# Altium schematic sheet AUX_PowerSupply.SchDoc
size A4
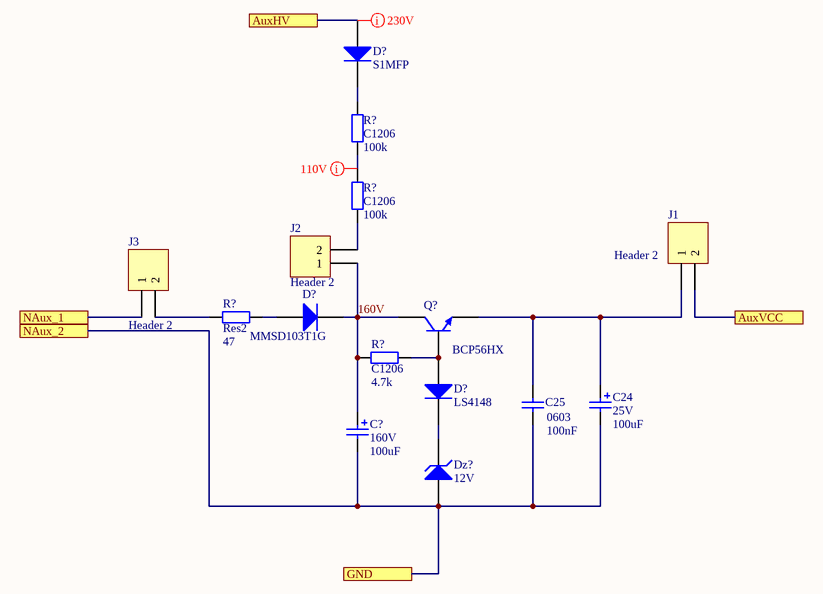
[diagram p0: AUX_PowerSupply.SchDoc]

## Parts
(Parts that share a designator on the sheet are numbered #1, #2 ... from top to bottom, then left to right.)
C24  25V  value 100uF  [100uF25V]
C25  0603  value 100nF  [1608[0603]]
C?  160V  value 100uF  [cap d=6.3]
D?#1  S1MFP  [MRA4007T3G]
D?#2  MMSD103T1G  [SOD-123]
D?#3  LS4148  [SOD-80]
Dz?  12V  [12V Zener]
J1  Header 2  [HDR1X2]
J2  Header 2  [HDR1X2]
J3  Header 2  [HDR1X2]
Q?  BCP56HX  [SOT223_M]
R?#1  C1206  value 100k  [C1206]
R?#2  C1206  value 100k  [C1206]
R?#3  Res2  value 47  [1608[0603]]
R?#4  C1206  value 4.7k  [C1206]

## Ports
AuxHV, AuxVCC, GND, NAux_1, NAux_2

## Nets
160V: C?.1 D?#2.2(K) J2.1 Q?.2(C) R?#4.2
AuxHV: D?#1.1(A) ; port AuxHV
AuxVCC: J1.2 ; port AuxVCC
GND: C24.2 C25.1 C?.2 Dz?.1(A) ; port NAux_2, port GND
NAux_1: J3.1 ; port NAux_1
NetC24_1: C24.1 C25.2 J1.1 Q?.3(E)
NetD?#1_2: D?#1.2(K) R?#1.2
NetD?#2_1: D?#2.1(A) R?#3.1
NetD?#3_1: D?#3.1(A) Q?.1(B) R?#4.1
NetD?#3_2: D?#3.2(K) Dz?.2(K)
NetJ2_2: J2.2 R?#2.1
NetJ3_2: J3.2 R?#3.2
NetR?#1_1: R?#1.1 R?#2.2

## Layout directives
mark named 230V: AuxHV
mark named 110V: NetR?#1_1

## Library data of the parts
C24 C? = Cap Pol2: Polarized Capacitor (Axial); Published: 8-Jun-2000; LatestRevisionDate: 17-Jul-2002; LatestRevisionNote: Re-released for DXP Platform.; PackageReference: POLAR0.8; Publisher: Altium Limited; PackageDescription: Polarized Capacitor; 2 Leads; Supplier 1: Digi-Key; Supplier Part Number 1: 493-2703-ND
C25 = Cap: Capacitor; Published: 8-Jun-2000; LatestRevisionDate: 17-Jul-2002; LatestRevisionNote: Re-released for DXP Platform.; PackageReference: RAD-0.3; Publisher: Altium Limited; PackageDescription: Radial Cap, Thru-Hole; 2 Leads; 0.3 in Pin Spacing; Supplier 1: Digi-Key; Supplier Part Number 1: 478-1138-6-ND
D?#1-D?#3 = Diode: Default Diode; Published: 8-Jun-2000; LatestRevisionDate: 17-Jul-2002; LatestRevisionNote: Re-released for DXP Platform.; PackageVersion: Sep-1996; PackageReference: SMC; Publisher: Altium Limited; PackageDescription: DO-214-AB/SMC; 2 C-Bend Leads; Body 7.9 x 5.9 mm, inc. leads (LxW); Code_JEDEC: DO-214-AB
  D?#1: Supplier 1: Mouser; Supplier Part Number 1: 863-MRA4007T3G
  D?#2: Supplier 1: Mouser; Supplier Part Number 1: 863-MMSD103T1G
Dz? = D Zener: Zener Diode; Published: 8-Jun-2000; LatestRevisionDate: 17-Jul-2002; LatestRevisionNote: Re-released for DXP Platform.; PackageReference: DIODE-0.7; Publisher: Altium Limited; PackageDescription: Diode, Thru-Hole; 2 Leads; 0.7 in Pin Spacing
J1-J3 = Header 2: Header, 2-Pin; LatestRevisionDate: 17-Jul-2002; LatestRevisionNote: Re-released for DXP Platform.; Publisher: Altium Limited
Q? = 2N3904: NPN General Purpose Amplifier; Published: 8-Jun-2000; LatestRevisionDate: 15-Jan-2003; LatestRevisionNote: PCB Footprint 'BCY-W3/D4.7' replaced; DatasheetVersion: 1997; PackageVersion: Sep-1998; PackageReference: TO-92A; Publisher: Altium Limited; PackageDescription: TO, Flat Index; 3 In-Line, Axial Leads; Body Dia. 4.5mm; Leads 0.51 x 0.48 mm (max); ComponentLink1Description: Manufacturer Link; ComponentLink1URL: http://www.fairchildsemi.com/; ComponentLink2Description: Datasheet; ComponentLink2URL: http://www.fairchildsemi.com/ds/2N%2F2N3904.pdf; Supplier 1: Arrow Electronics, Inc.; Supplier Part Number 1: BCP55-16F
R?#1-R?#4 = Res2: Resistor; Published: 8-Jun-2000; LatestRevisionDate: 17-Jul-2002; LatestRevisionNote: Re-released for DXP Platform.; PackageReference: AXIAL-0.4; Publisher: Altium Limited; PackageDescription: Axial Device, Thru-Hole; 2 Leads; 0.4 in Pin Spacing; Supplier 1: Digi-Key; Supplier Part Number 1: 541-220KFDKR-ND